# EAGLE schematic CHIRIMENBlankshield (EAGLE 7.5.0)
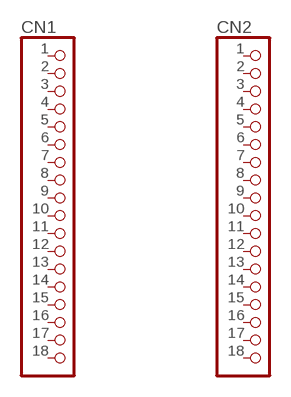
[diagram p0: schematic, sheet 1]

## Parts
CN1  PINHD-1X18  [1X18]
CN2  PINHD-1X18  [1X18]
Unconnected: CN1.1 CN1.2 CN1.3 CN1.4 CN1.5 CN1.6 CN1.7 CN1.8 CN1.9 CN1.10 CN1.11 CN1.12 CN1.13 CN1.14 CN1.15 CN1.16 CN1.17 CN1.18 CN2.1 CN2.2 CN2.3 CN2.4 CN2.5 CN2.6 CN2.7 CN2.8 CN2.9 CN2.10 CN2.11 CN2.12 CN2.13 CN2.14 CN2.15 CN2.16 CN2.17 CN2.18

## Library data of the parts
CN1 CN2 = pinhead:PINHD-1X18: PIN HEADER